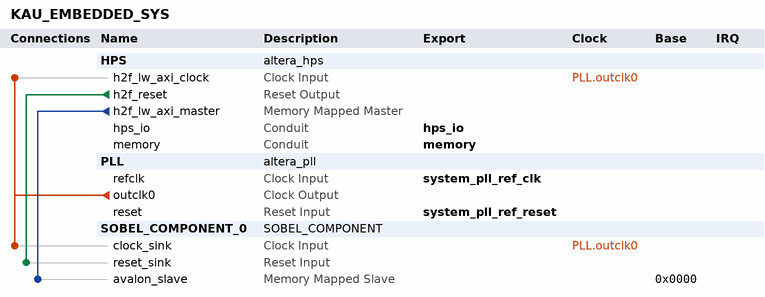
[diagram p0: system contents]
# Platform Designer (Qsys) system KAU_EMBEDDED_SYS, Cyclone V 5CSEMA5F31C6
# Parameters at their usual value, and those the tool derives, are not listed.
package require -exact qsys 18.1
create_system KAU_EMBEDDED_SYS
set_project_property DEVICE_FAMILY {Cyclone V}
set_project_property DEVICE 5CSEMA5F31C6

add_instance HPS altera_hps 18.1
set_instance_parameter_value HPS EMAC1_Mode RGMII
set_instance_parameter_value HPS EMAC1_PinMuxing {HPS I/O Set 0}
set_instance_parameter_value HPS F2SCLK_COLDRST_Enable false
set_instance_parameter_value HPS F2SCLK_DBGRST_Enable false
set_instance_parameter_value HPS F2SCLK_WARMRST_Enable false
set_instance_parameter_value HPS F2SINTERRUPT_Enable true
set_instance_parameter_value HPS F2S_Width 0
set_instance_parameter_value HPS FPGA_PERIPHERAL_OUTPUT_CLOCK_FREQ_EMAC0_GTX_CLK 100
set_instance_parameter_value HPS FPGA_PERIPHERAL_OUTPUT_CLOCK_FREQ_EMAC0_MD_CLK 100.0
set_instance_parameter_value HPS FPGA_PERIPHERAL_OUTPUT_CLOCK_FREQ_EMAC1_GTX_CLK 100
set_instance_parameter_value HPS FPGA_PERIPHERAL_OUTPUT_CLOCK_FREQ_EMAC1_MD_CLK 100.0
set_instance_parameter_value HPS HPS_PROTOCOL DDR3
set_instance_parameter_value HPS I2C0_Mode I2C
set_instance_parameter_value HPS I2C0_PinMuxing {HPS I/O Set 0}
set_instance_parameter_value HPS I2C1_Mode I2C
set_instance_parameter_value HPS I2C1_PinMuxing {HPS I/O Set 0}
set_instance_parameter_value HPS LWH2F_Enable true
set_instance_parameter_value HPS MEM_BANKADDR_WIDTH 3
set_instance_parameter_value HPS MEM_CLK_FREQ 400.0
set_instance_parameter_value HPS MEM_COL_ADDR_WIDTH 10
set_instance_parameter_value HPS MEM_DQ_WIDTH 32
set_instance_parameter_value HPS MEM_DRV_STR RZQ/6
set_instance_parameter_value HPS MEM_ROW_ADDR_WIDTH 15
set_instance_parameter_value HPS MEM_RTT_NOM RZQ/6
set_instance_parameter_value HPS MEM_RTT_WR {Dynamic ODT off}
set_instance_parameter_value HPS MEM_TCL 7
set_instance_parameter_value HPS MEM_TFAW_NS 45.0
set_instance_parameter_value HPS MEM_TRAS_NS 36.0
set_instance_parameter_value HPS MEM_TRCD_NS 13.125
set_instance_parameter_value HPS MEM_TRFC_NS 300.0
set_instance_parameter_value HPS MEM_TRP_NS 13.125
set_instance_parameter_value HPS MEM_VENDOR Micron
set_instance_parameter_value HPS MEM_WTCL 7
set_instance_parameter_value HPS QSPI_Mode {1 SS}
set_instance_parameter_value HPS QSPI_PinMuxing {HPS I/O Set 0}
set_instance_parameter_value HPS REF_CLK_FREQ 25.0
set_instance_parameter_value HPS S2FCLK_USER2CLK 5
set_instance_parameter_value HPS S2F_Width 0
set_instance_parameter_value HPS SDIO_Mode {4-bit Data}
set_instance_parameter_value HPS SDIO_PinMuxing {HPS I/O Set 0}
set_instance_parameter_value HPS SPIM1_Mode {Single Slave Select}
set_instance_parameter_value HPS SPIM1_PinMuxing {HPS I/O Set 0}
set_instance_parameter_value HPS STM_Enable true
set_instance_parameter_value HPS TIMING_BOARD_AC_SKEW 0.02
set_instance_parameter_value HPS TIMING_BOARD_AC_TO_CK_SKEW 0.01
set_instance_parameter_value HPS TIMING_BOARD_DQ_TO_DQS_SKEW 0.05
set_instance_parameter_value HPS TIMING_BOARD_MAX_CK_DELAY 0.03
set_instance_parameter_value HPS TIMING_BOARD_MAX_DQS_DELAY 0.02
set_instance_parameter_value HPS TIMING_BOARD_SKEW_BETWEEN_DQS 0.06
set_instance_parameter_value HPS TIMING_BOARD_SKEW_CKDQS_DIMM_MAX 0.12
set_instance_parameter_value HPS TIMING_BOARD_SKEW_CKDQS_DIMM_MIN 0.06
set_instance_parameter_value HPS TIMING_BOARD_SKEW_WITHIN_DQS 0.01
set_instance_parameter_value HPS TIMING_TDH 65
set_instance_parameter_value HPS TIMING_TDQSCK 255
set_instance_parameter_value HPS TIMING_TDQSQ 125
set_instance_parameter_value HPS TIMING_TDS 30
set_instance_parameter_value HPS TIMING_TIH 140
set_instance_parameter_value HPS TIMING_TIS 190
set_instance_parameter_value HPS TIMING_TQSH 0.4
set_instance_parameter_value HPS UART0_Mode {No Flow Control}
set_instance_parameter_value HPS UART0_PinMuxing {HPS I/O Set 0}
set_instance_parameter_value HPS USB1_Mode SDR
set_instance_parameter_value HPS USB1_PinMuxing {HPS I/O Set 0}
set_instance_parameter_value HPS desired_cfg_clk_mhz 100.0
set_instance_parameter_value HPS desired_qspi_clk_mhz 400.0

add_instance PLL altera_pll 18.1
set_instance_parameter_value PLL gui_device_speed_grade 1
set_instance_parameter_value PLL gui_number_of_clocks 1
set_instance_parameter_value PLL gui_operation_mode direct
set_instance_parameter_value PLL gui_output_clock_frequency0 100.0
set_instance_parameter_value PLL gui_pll_mode {Integer-N PLL}
set_instance_parameter_value PLL gui_reference_clock_frequency 50.0
set_instance_parameter_value PLL gui_use_locked false

add_instance SOBEL_COMPONENT_0 SOBEL_COMPONENT 1.0

# connections
add_connection PLL.outclk0 HPS.h2f_lw_axi_clock clock
add_connection PLL.outclk0 SOBEL_COMPONENT_0.clock_sink clock
add_connection HPS.h2f_reset SOBEL_COMPONENT_0.reset_sink reset
add_connection HPS.h2f_lw_axi_master SOBEL_COMPONENT_0.avalon_slave avalon
set_connection_parameter_value HPS.h2f_lw_axi_master/SOBEL_COMPONENT_0.avalon_slave baseAddress 0x0000

# exported interfaces
add_interface hps_io conduit end
set_interface_property hps_io EXPORT_OF HPS.hps_io
add_interface memory conduit end
set_interface_property memory EXPORT_OF HPS.memory
add_interface system_pll_ref_clk clock sink
set_interface_property system_pll_ref_clk EXPORT_OF PLL.refclk
add_interface system_pll_ref_reset reset sink
set_interface_property system_pll_ref_reset EXPORT_OF PLL.reset

set_interconnect_requirement {$system} qsys_mm.clockCrossingAdapter HANDSHAKE
set_interconnect_requirement {$system} qsys_mm.enableEccProtection FALSE
set_interconnect_requirement {$system} qsys_mm.insertDefaultSlave FALSE
set_interconnect_requirement {$system} qsys_mm.maxAdditionalLatency 1

save_system KAU_EMBEDDED_SYS.qsys
